# EAGLE schematic powerGardenBoard_02 (EAGLE 6.2)
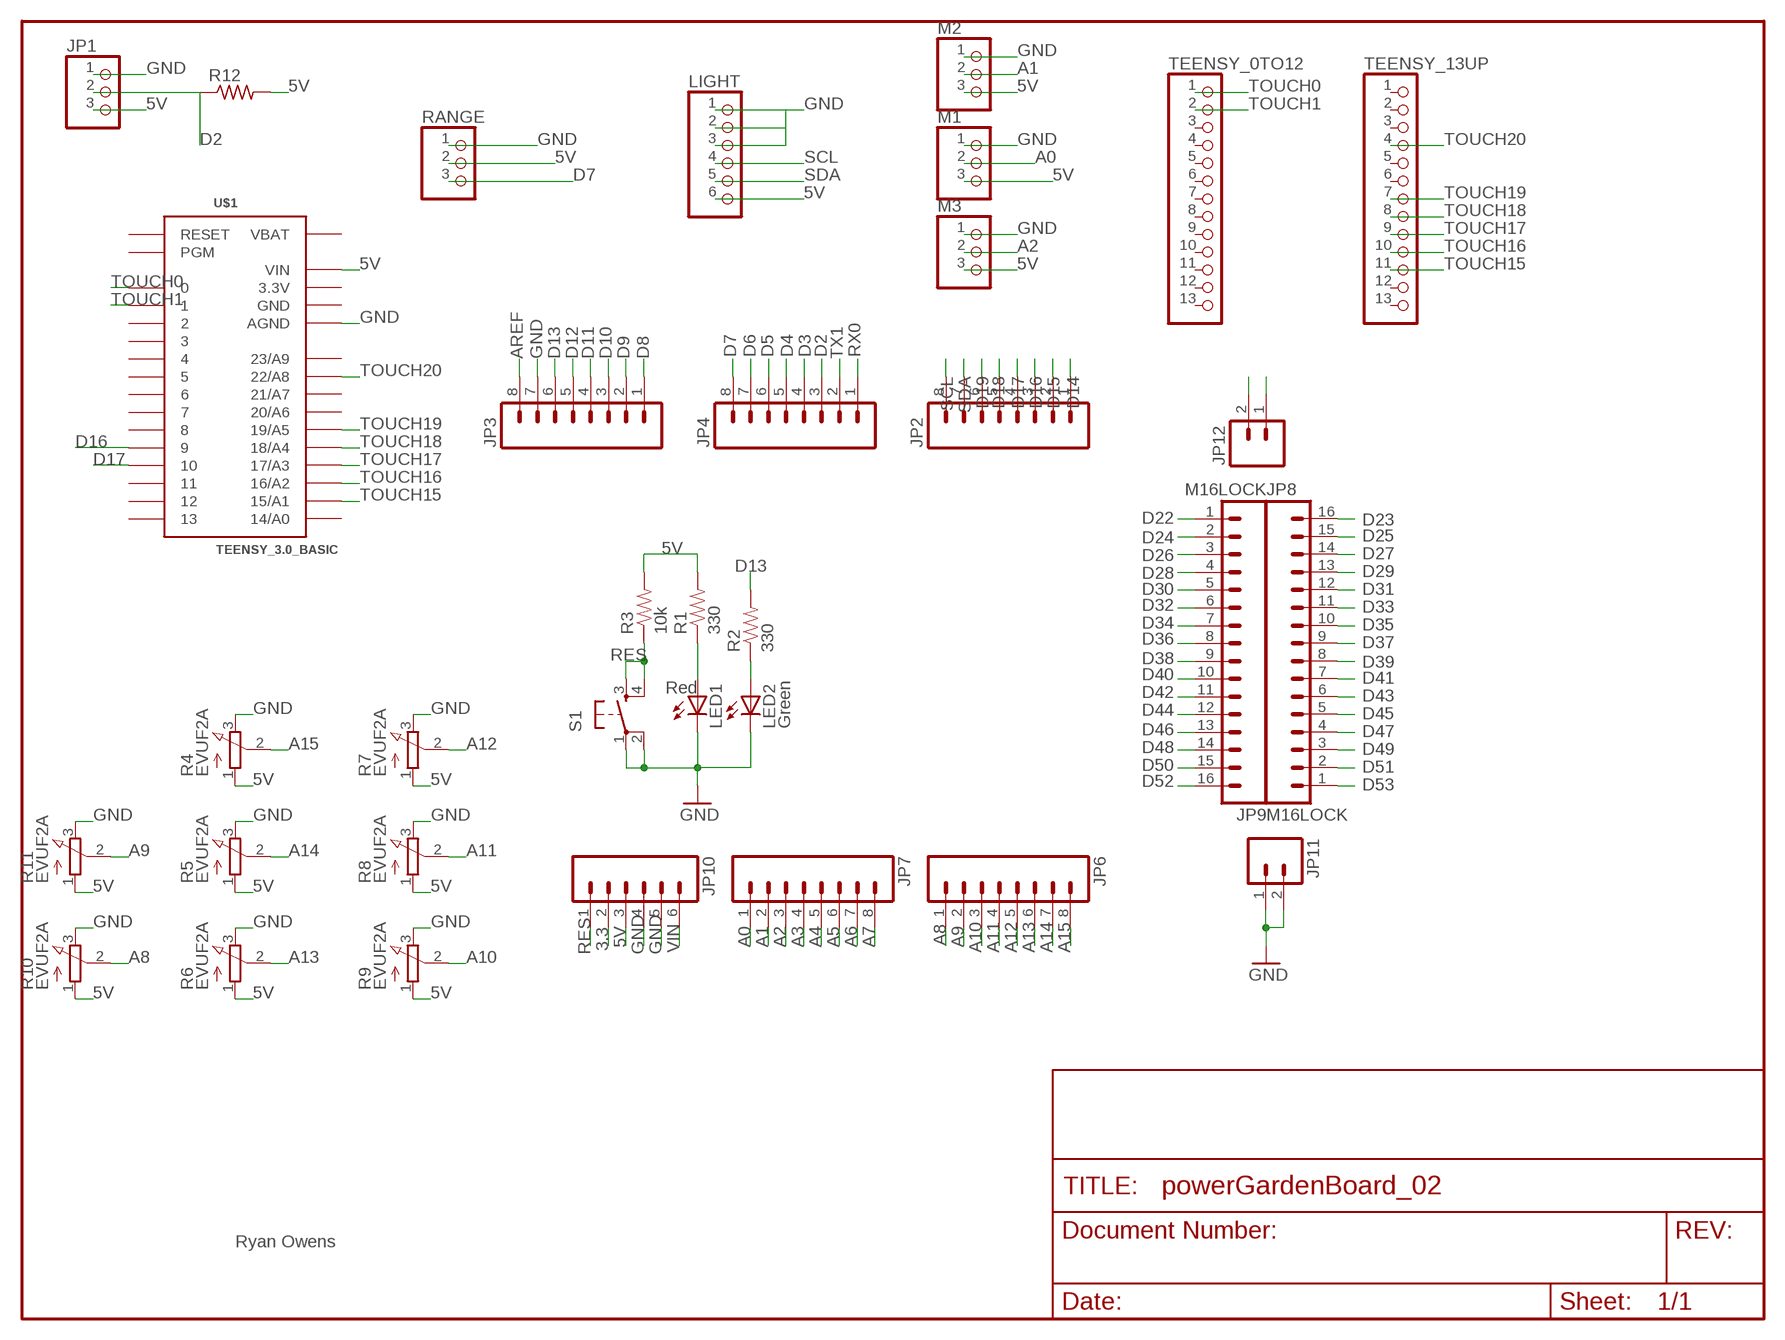
[diagram p0: schematic, sheet 1]

## Parts
JP1  PINHD-1X3  [1X03]
JP2  M08LOCK  [1X08_LOCK]
JP3  M08LOCK  [1X08_LOCK]
JP4  M08LOCK  [1X08_LOCK]
JP6  M08LOCK  [1X08_LOCK]
JP7  M08LOCK  [1X08_LOCK]
JP8  M16LOCK  [1X16_LOCK]
JP9  M16LOCK  [1X16_LOCK]
JP10  M06LOCK  [1X06_LOCK]
JP11  M02LOCK  [1X02_LOCK]
JP12  M02LOCK  [1X02_LOCK]
LED1  Red  LED5MM  [LED5MM]
LED2  Green  LED5MM  [LED5MM]
LIGHT  PINHD-1X6  [1X06]
M1  PINHD-1X3  [1X03]
M2  PINHD-1X3  [1X03]
M3  PINHD-1X3  [1X03]
R1  330  RESISTORPTH1  [AXIAL-0.3]
R2  330  RESISTORPTH1  [AXIAL-0.3]
R3  10k  RESISTORPTH1  [AXIAL-0.3]
R4  EVUF2A  [EVUF]
R5  EVUF2A  [EVUF]
R6  EVUF2A  [EVUF]
R7  EVUF2A  [EVUF]
R8  EVUF2A  [EVUF]
R9  EVUF2A  [EVUF]
R10  EVUF2A  [EVUF]
R11  EVUF2A  [EVUF]
R12  R-US_0204/7  [0204/7]
RANGE  PINHD-1X3  [1X03]
S1  TAC_SWITCHPTH  [TACTILE-PTH]
TEENSY_0TO12  PINHD-1X13_BIG  [1X13-BIG]
TEENSY_13UP  PINHD-1X13_BIG  [1X13-BIG]
U$1  TEENSY_3.0_BASIC  [TEENSY_3.0_BASIC]

## Nets
3.3: JP10.2
5V: JP1.3 JP10.3 LIGHT.6 M1.3 M2.3 M3.3 R1.P$2 R3.P$2 R4.1(A) R5.1(A) R6.1(A) R7.1(A) R8.1(A) R9.1(A) R10.1(A) R11.1(A) R12.2 RANGE.2 U$1.VIN
5V@1: JP12.1 JP12.2
A0: JP7.1 M1.2
A1: JP7.2 M2.2
A2: JP7.3 M3.2
A3: JP7.4
A4: JP7.5
A5: JP7.6
A6: JP7.7
A7: JP7.8
A8: JP6.1 R10.2(S)
A9: JP6.2 R11.2(S)
A10: JP6.3 R9.2(S)
A11: JP6.4 R8.2(S)
A12: JP6.5 R7.2(S)
A13: JP6.6 R6.2(S)
A14: JP6.7 R5.2(S)
A15: JP6.8 R4.2(S)
AREF: JP3.8
D2: JP1.2 JP4.3 R12.1
D3: JP4.4
D4: JP4.5
D5: JP4.6
D6: JP4.7
D7: JP4.8 RANGE.3
D8: JP3.1
D9: JP3.2
D10: JP3.3
D11: JP3.4
D12: JP3.5
D13: JP3.6 R2.P$2
D14: JP2.1
D15: JP2.2
D16: JP2.3 U$1.9
D17: JP2.4 U$1.10
D18: JP2.5
D19: JP2.6
D22: JP9.1
D23: JP8.16
D24: JP9.2
D25: JP8.15
D26: JP9.3
D27: JP8.14
D28: JP9.4
D29: JP8.13
D30: JP9.5
D31: JP8.12
D32: JP9.6
D33: JP8.11
D34: JP9.7
D35: JP8.10
D36: JP9.8
D37: JP8.9
D38: JP9.9
D39: JP8.8
D40: JP9.10
D41: JP8.7
D42: JP9.11
D43: JP8.6
D44: JP9.12
D45: JP8.5
D46: JP9.13
D47: JP8.4
D48: JP9.14
D49: JP8.3
D50: JP9.15
D51: JP8.2
D52: JP9.16
D53: JP8.1
GND: JP1.1 JP3.7 JP10.4 JP10.5 JP11.1 JP11.2 LED1.K(C) LED2.K(C) LIGHT.1 LIGHT.2 LIGHT.3 M1.1 M2.1 M3.1 R4.3(E) R5.3(E) R6.3(E) R7.3(E) R8.3(E) R9.3(E) R10.3(E) R11.3(E) RANGE.1 S1.1 S1.2 U$1.AGND
N$126: LED1.A R1.P$1
N$127: LED2.A R2.P$1
RES: JP10.1 R3.P$1 S1.3 S1.4
RX0: JP4.1
SCL: JP2.8 LIGHT.4
SDA: JP2.7 LIGHT.5
TOUCH0: TEENSY_0TO12.1 U$1.0
TOUCH1: TEENSY_0TO12.2 U$1.1
TOUCH15: TEENSY_13UP.11 U$1.15/A1
TOUCH16: TEENSY_13UP.10 U$1.16/A2
TOUCH17: TEENSY_13UP.9 U$1.17/A3
TOUCH18: TEENSY_13UP.8 U$1.18/A4
TOUCH19: TEENSY_13UP.7 U$1.19/A5
TOUCH20: TEENSY_13UP.4 U$1.22/A8
TX1: JP4.2
VIN: JP10.6
Unconnected: TEENSY_0TO12.3 TEENSY_0TO12.4 TEENSY_0TO12.5 TEENSY_0TO12.6 TEENSY_0TO12.7 TEENSY_0TO12.8 TEENSY_0TO12.9 TEENSY_0TO12.10 TEENSY_0TO12.11 TEENSY_0TO12.12 TEENSY_0TO12.13 TEENSY_13UP.1 TEENSY_13UP.2 TEENSY_13UP.3 TEENSY_13UP.5 TEENSY_13UP.6 TEENSY_13UP.12 TEENSY_13UP.13 U$1.2 U$1.3 U$1.4 U$1.5 U$1.6 U$1.7 U$1.8 U$1.11 U$1.12 U$1.13 U$1.14/A0 U$1.20/A6 U$1.21/A7 U$1.23/A9 U$1.PGM U$1.RESET

## Notes on the sheet
- Ryan Owens

## Power pins joined to a net without a drawn wire
3.3V: U$1.3.3V U$1.3.3V1(3.3V)
GND: U$1.GND U$1.GND1(GND)
VBAT: U$1.VBAT

## Library data of the parts
JP1 M1-M3 RANGE = adafruit:PINHD-1X3: PIN HEADER
JP2-JP4 JP6 JP7 = SparkFun:M08: Header 8 Standard 8-pin 0.1" header. Use with straight break away headers (SKU : PRT-00116), right angle break away headers (PRT-00553), swiss pins (PRT-00743), machine pins (PRT-00117), and female headers (PRT-00115).
JP8 JP9 = SparkFun:M16
JP10 = SparkFun:M06: Header 6 Standard 6-pin 0.1" header. Use with straight break away headers (SKU : PRT-00116), right angle break away headers (PRT-00553), swiss pins (PRT-00743), machine pins (PRT-00117), and female headers (PRT-00115). Molex polarized connector foot print use with SKU : PRT-08094 with associated crimp pins and housings. NOTES ON THE VARIANTS LOCK and LOCK_LONGPADS... This footprint was designed to help hold the alignment of a through-hole component (i.e. 6-pin header) while soldering it into place. You may notice that each hole has been shifted either up or down by 0.005 of an inch from it's more standard position (which is a perfectly straight line). This slight alteration caused the pins (the squares in the middle) to touch the edges of the holes. Because they are alternating, it causes a "brace" to hold the component in place. 0.005 has proven to be the perfect amount of "off-center" position when using our standard breakaway headers. Although looks a little odd when you look at the bare footprint, once you have a header in there, the alteration is very hard to notice. Also, if you push a header all the way into place, it is covered up entirely on the bottom side. This idea of altering the position of holes to aid alignment will be further integrated into the Sparkfun Library for other footprints. It can help hold any component with 3 or more connection pins.
JP11 JP12 = SparkFun:M02: Header 2 Standard 2-pin 0.1" header. Use with straight break away headers (SKU : PRT-00116), right angle break away headers (PRT-00553), swiss pins (PRT-00743), machine pins (PRT-00117), and female headers (PRT-00115). Molex polarized connector foot print use with SKU : PRT-08233 with associated crimp pins and housings.
LED1 LED2 = SparkFun:LED: LEDs Standard schematic elements and footprints for 5mm, 3mm, 1206, and 0603 sized LEDs. 5mm - Spark Fun Electronics SKU : COM-00529 (and others)
LIGHT = adafruit:PINHD-1X6: PIN HEADER
R1-R3 = SparkFun:RESISTOR: Resistor Basic schematic elements and footprints for 0603, 1206, and PTH 1/10th watt (small) resistors.
R4-R11 = pot:EVU: 9 mm Square Rotary Potentiometers Source: Panasonic
R12 = adafruit:R-US_: RESISTOR, American symbol
S1 = SparkFun:TAC_SWITCH: Momentary Switch Button commonly used for reset or general input. Spark Fun Electronics SKU : COM-00097
TEENSY_0TO12 TEENSY_13UP = adafruit:PINHD-1X13: PIN HEADER
U$1 = Teensy3.0:TEENSY_3.0_BASIC: Basic Teensy 3.0 with none of the 'inner' pins enabled. See '+4', 'AllAnalogPins", and 'AllPins' packages for additional pin holes, as needed.

## Net classes
0 default: width 0.356 mm, drill 0.356 mm